# Altium schematic sheet One_Shot.SchDoc
size A
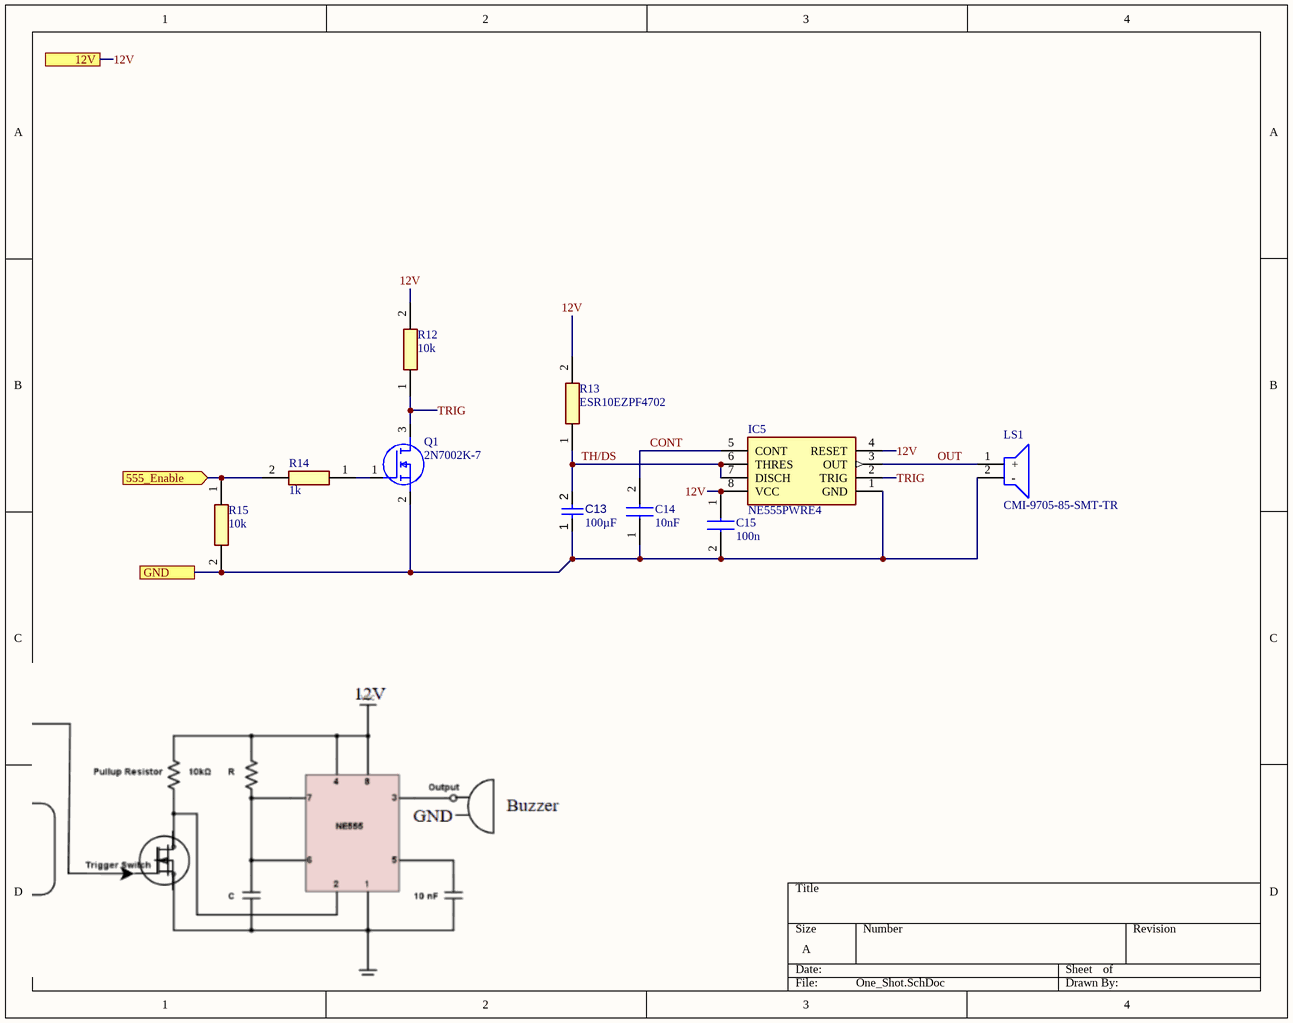
[diagram p0: One_Shot.SchDoc]

## Parts
C13  value 100µF  [CAPC0805(2012)145_L]  (hidden comment: Capacitor 100µF +/-20% 6.3V 0805)
C14  10nF  [C0805]
C15  100n  [CAPC2012X147N]
IC5  NE555PWRE4  [SOP65P640X120-8N]
LS1  CMI-9705-85-SMT-TR  [CMI970585SMTTR]
Q1  2N7002K-7  [SOT96P240X115-3N]
R12  10k  [RESC2012X60N]
R13  ESR10EZPF4702  [RESC2012X65N]
R14  1k  [RESC2013X65N]
R15  10k  [RESC2012X60N]

## Ports
12V, 555_Enable (in), GND

## Nets
12V: C15.1 IC5.4(RESET) IC5.8(VCC) R12.2 R13.2 ; port 12V
555_Enable: R14.2 R15.1 ; port 555_Enable
CONT: C14.2 IC5.5(CONT)
GND: C13.1 C14.1 C15.2 IC5.1(GND) LS1.2(-) Q1.2(S) R15.2 ; port GND
OUT: IC5.3(OUT) LS1.1(+)
TH/DS: C13.2 IC5.6(THRES) IC5.7(DISCH) R13.1
TRIG: IC5.2(TRIG) Q1.3(D) R12.1
NetQ1_1: Q1.1(G) R14.1

## Library data of the parts
C13 = CMP-001-00054-4: Chip Capacitor, 100µF +/-20%, 6.3V, 0805, Thickness 1.45 mm; Tolerance: 10%; Min Operating Temperature: -55°C; Max Operating Temperature: 85°C; Pins: 2; Mounting Technology: SMT; Case/Package: 0805; Voltage Rating: 6.3V
C14 = C0805C103F1GACAUTO: Capacitor; Manufacturer_Name: Yageo Group; Datasheet Link: https://www.yageogroup.com/content/datasheet/asset/file/KEM_C1022_C0G_AUTO_SMD; Height: 1.1mm; Manufacturer_Part_Number: C0805C103F1GACAUTO; Mouser Part Number: 80-C0805C103F1GAUTO; Mouser Price/Stock: https://www.mouser.co.uk/ProductDetail/KEMET/C0805C103F1GACAUTO?qs=SKxV22VtNmdH%252BCKBcUCnZA%3D%3D; Arrow Part Number: C0805C103F1GACAUTO; Arrow Price/Stock: https://www.arrow.com/en/products/c0805c103f1gacauto/kemet-corporation?utm_currency=USD&region=nac
C15 = KGF21BR71H104KT: Capacitor; Manufacturer_Name: Kyocera AVX; Datasheet Link: https://www.mouser.fr/datasheet/2/40/KGF-3223650.pdf; Height: 1.47mm; Manufacturer_Part_Number: KGF21BR71H104KT; Mouser Part Number: 581-KGF21BR71H104KT; Mouser Price/Stock: https://www.mouser.co.uk/ProductDetail/KYOCERA-AVX/KGF21BR71H104KT?qs=Jm2GQyTW%2FbjYyKCvVWAEOw%3D%3D; Arrow Part Number: KGF21BR71H104KT; Arrow Price/Stock: https://www.arrow.com/en/products/kgf21br71h104kt/avx?utm_currency=USD&region=nac
IC5 = NE555PWRE4: Integrated Circuit; Manufacturer_Name: Texas Instruments; Datasheet Link: http://www.ti.com/lit/ds/symlink/ne555.pdf; Height: 1.2mm; Manufacturer_Part_Number: NE555PWRE4; Mouser Part Number: 595-NE555PWRE4; Mouser Price/Stock: https://www.mouser.co.uk/ProductDetail/Texas-Instruments/NE555PWRE4?qs=rLYyFdxB%2Fmr6qUodVTnTjw%3D%3D; Arrow Part Number: NE555PWRE4; Arrow Price/Stock: https://www.arrow.com/en/products/ne555pwre4/texas-instruments
LS1 = CMI-9705-85-SMT-TR: Loudspeaker or Buzzer; Manufacturer_Name: Same Sky; Datasheet Link: https://www.sameskydevices.com/product/resource/CMI-9705-85-SMT-TR.pdf; Height: 5.5mm; Manufacturer_Part_Number: CMI-9705-85-SMT-TR; Mouser Part Number: 490-CMI-9705-85SMTTR; Mouser Price/Stock: https://www.mouser.co.uk/ProductDetail/CUI-Devices/CMI-9705-85-SMT-TR?qs=P1JMDcb91o4Wun0lW9vptg%3D%3D; Arrow Part Number: CMI-9705-85-SMT-TR; Arrow Price/Stock: https://www.arrow.com/en/products/cmi-9705-85-smt-tr/cui-devices?region=nac
Q1 = 2N7002K-7: MOSFET (N-Channel); Manufacturer_Name: Diodes Incorporated; Description: N-CHANNEL ENHANCEMENT MODE MOSFET; Datasheet Link: https://www.diodes.com//assets/Datasheets/2N7002K.pdf; Height: 1.15mm; Manufacturer_Part_Number: 2N7002K-7; Mouser Part Number: 621-2N7002K-7; Mouser Price/Stock: https://www.mouser.co.uk/ProductDetail/Diodes-Incorporated/2N7002K-7?qs=rGAXPo9uwV0%2Fp9r5KJ7huA%3D%3D; Arrow Part Number: 2N7002K-7; Arrow Price/Stock: https://www.arrow.com/en/products/2n7002k-7/diodes-incorporated.html?utm_currency=USD&region=nac
R12 R15 = RV0805JR-0710KL: Resistor; Manufacturer_Name: Yageo Group; Datasheet Link: https://www.mouser.in/new/yageo/yageo-rv-resistors/; Height: 0.6mm; Manufacturer_Part_Number: RV0805JR-0710KL
R13 = ESR10EZPF4702: Resistor; Manufacturer_Name: ROHM Semiconductor; Datasheet Link: http://uk.rs-online.com/web/p/products/1674355; Height: 0.65mm; Manufacturer_Part_Number: ESR10EZPF4702; Mouser Part Number: 755-ESR10EZPF4702; Mouser Price/Stock: https://www.mouser.com/Search/Refine.aspx?Keyword=755-ESR10EZPF4702
R14 = WCR0805LF1001FPLT: Resistor; Manufacturer_Name: TT Electronics; Datasheet Link: https://g.componentsearchengine.com/Datasheets/1/WCR0805LF1001FPLT.pdf; Height: 0.65mm; Manufacturer_Part_Number: WCR0805LF1001FPLT; Mouser Part Number: 66-WCR0805LF1001FPLT; Mouser Price/Stock: https://www.mouser.com/Search/Refine.aspx?Keyword=66-WCR0805LF1001FPLT